# EAGLE design Conectores M2 v1 (EAGLE 9.6.2)
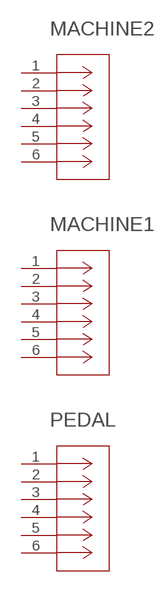
[diagram p0: schematic, sheet 1]

## Parts
MACHINE1  ACJS-MHDR  [CONN_MHDR_AMP]
MACHINE2  ACJS-MHDR  [CONN_MHDR_AMP]
PEDAL  ACJS-MHDR  [CONN_MHDR_AMP]
Unconnected: MACHINE1.1 MACHINE1.2 MACHINE1.3 MACHINE1.4 MACHINE1.5 MACHINE1.6 MACHINE2.1 MACHINE2.2 MACHINE2.3 MACHINE2.4 MACHINE2.5 MACHINE2.6 PEDAL.1 PEDAL.2 PEDAL.3 PEDAL.4 PEDAL.5 PEDAL.6

## Library data of the parts
MACHINE1 MACHINE2 PEDAL = ACJSMHDR:ACJS-MHDR; BUILT_BY: EMA_Matt; COPYRIGHT: Copyright (C) 2018 Accelerated Designs. All rights reserved; MANUFACTURER_PART_NUMBER: ACJS-MHDR; SOURCELIBRARY: Amphenol_2019-10-30; VENDOR: Amphenol

## Board
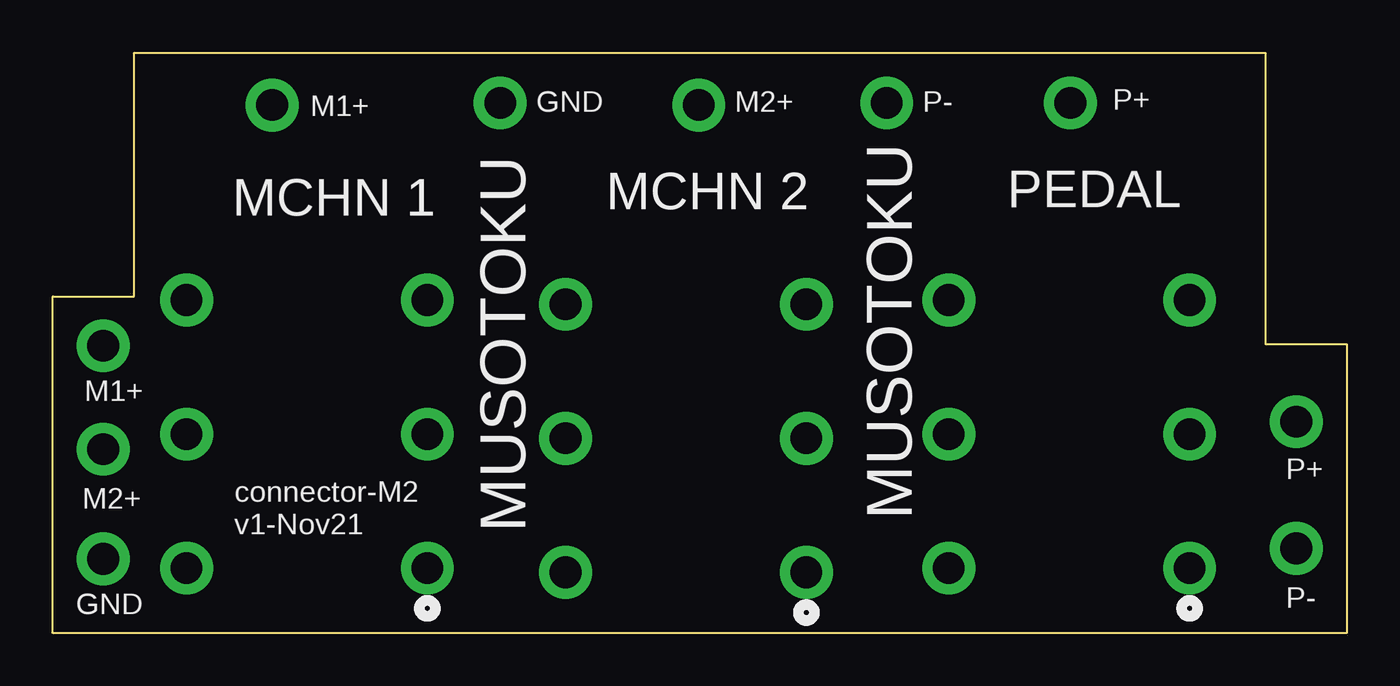
[diagram p1: board, top side]
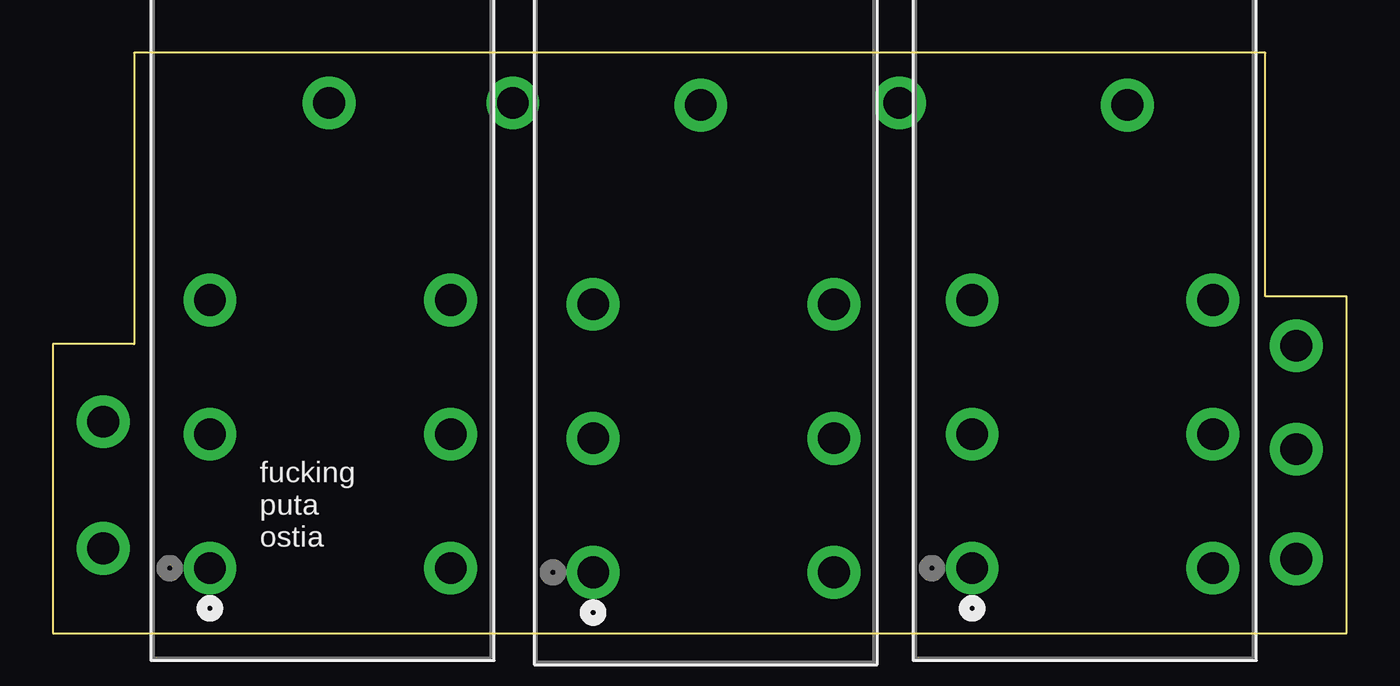
[diagram p2: board, bottom side, seen from below]

Size 61.28 x 27.5 mm. Coordinates in mm from the lower left corner, seen from the top.
Outline: 61.28,13.7 61.28,0 0,0 0,15.96 3.85,15.96 3.85,27.5 57.43,27.5 57.43,13.7 61.28,13.7
Copper layers (1*16): Top 0.035mm / dielectric 1.5mm / Bottom 0.035mm
Design rules "default": minimum track width 6mil, minimum drill 0.35mm, track to track 6mil, track to pad 6mil, pad to pad 6mil, via to via 6mil, smd to smd 6mil, copper to edge 40mil, drill to drill 6mil, minimum pad ring 10mil, minimum via ring 8mil, stop-mask expansion 4mil, vias tented up to drill 0mil, thermal gap 10mil

### Footprints (pad centres in the part's own frame; a part is rotated, then mirrored left to right if it is on the bottom)
CONN_MHDR_AMP = drill 1.5 pad 2.5: 1 0,0; 2 -6.35,0; 3 -12.7,0; 4 0,11.405; 5 -6.35,11.405; 6 -12.7,11.405

### Placement (x,y rotation side)
MACHINE1  53.84,3.08 270 bottom
MACHINE2  35.69,2.88 270 bottom
PEDAL  17.74,3.08 270 bottom

### Tracks (layer width: path | path; a pad name or v marks a point on that pad's centre or on a via)
GND  (via drill 1.5 pad 2.5)
  other vias: 2.39,13.62
GND1  (via drill 1.5 pad 2.5)
  other vias: 2.39,8.72
GND2  (via drill 1.5 pad 2.5)
  other vias: 2.39,3.52
GND3  (via drill 1.5 pad 2.5)
  other vias: 58.89,10.02
GND4  (via drill 1.5 pad 2.5)
  other vias: 48.19,25.12
GND5  (via drill 1.5 pad 2.5)
  other vias: 10.39,25.02
GND6  (via drill 1.5 pad 2.5)
  other vias: 21.19,25.12
GND7  (via drill 1.5 pad 2.5)
  other vias: 39.49,25.12
GND8  (via drill 1.5 pad 2.5)
  other vias: 30.59,25.02
GND9  (via drill 1.5 pad 2.5)
  other vias: 58.89,4.02

### Text on the board
tNames: P+ | M1+ | GND | M2+ | P- | MCHN 1 | MCHN 2 | PEDAL | M1+ | P+ | M2+ | MUSOTOKU | MUSOTOKU | connector-M2 / v1-Nov21 | GND | P-
bNames: fucking / puta / ostia